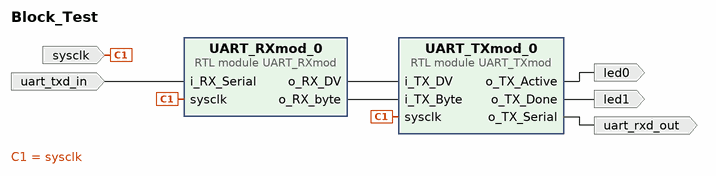
[diagram p0: block diagram of the top level]
# Vivado block design Block_Test, xc7a35tcpg236-1, Vivado 2024.2
create_bd_design Block_Test

create_bd_port -dir I sysclk
create_bd_port -dir O led0
create_bd_port -dir O led1
create_bd_port -dir O uart_rxd_out
create_bd_port -dir I uart_txd_in

create_bd_cell -type module -reference UART_RXmod UART_RXmod_0
create_bd_cell -type module -reference UART_TXmod UART_TXmod_0

# ---- connections ----

connect_bd_net [get_bd_pins UART_RXmod_0/o_RX_DV] [get_bd_pins UART_TXmod_0/i_TX_DV]
connect_bd_net [get_bd_pins UART_RXmod_0/o_RX_byte] [get_bd_pins UART_TXmod_0/i_TX_Byte]
connect_bd_net [get_bd_pins UART_TXmod_0/o_TX_Active] [get_bd_ports led0]
connect_bd_net [get_bd_pins UART_TXmod_0/o_TX_Done] [get_bd_ports led1]
connect_bd_net [get_bd_pins UART_TXmod_0/o_TX_Serial] [get_bd_ports uart_rxd_out]
connect_bd_net -net i_RX_Serial_0_1 [get_bd_ports uart_txd_in] [get_bd_pins UART_RXmod_0/i_RX_Serial]
connect_bd_net -net sysclk_0_1 [get_bd_ports sysclk] [get_bd_pins UART_TXmod_0/sysclk] [get_bd_pins UART_RXmod_0/sysclk]

validate_bd_design
save_bd_design
